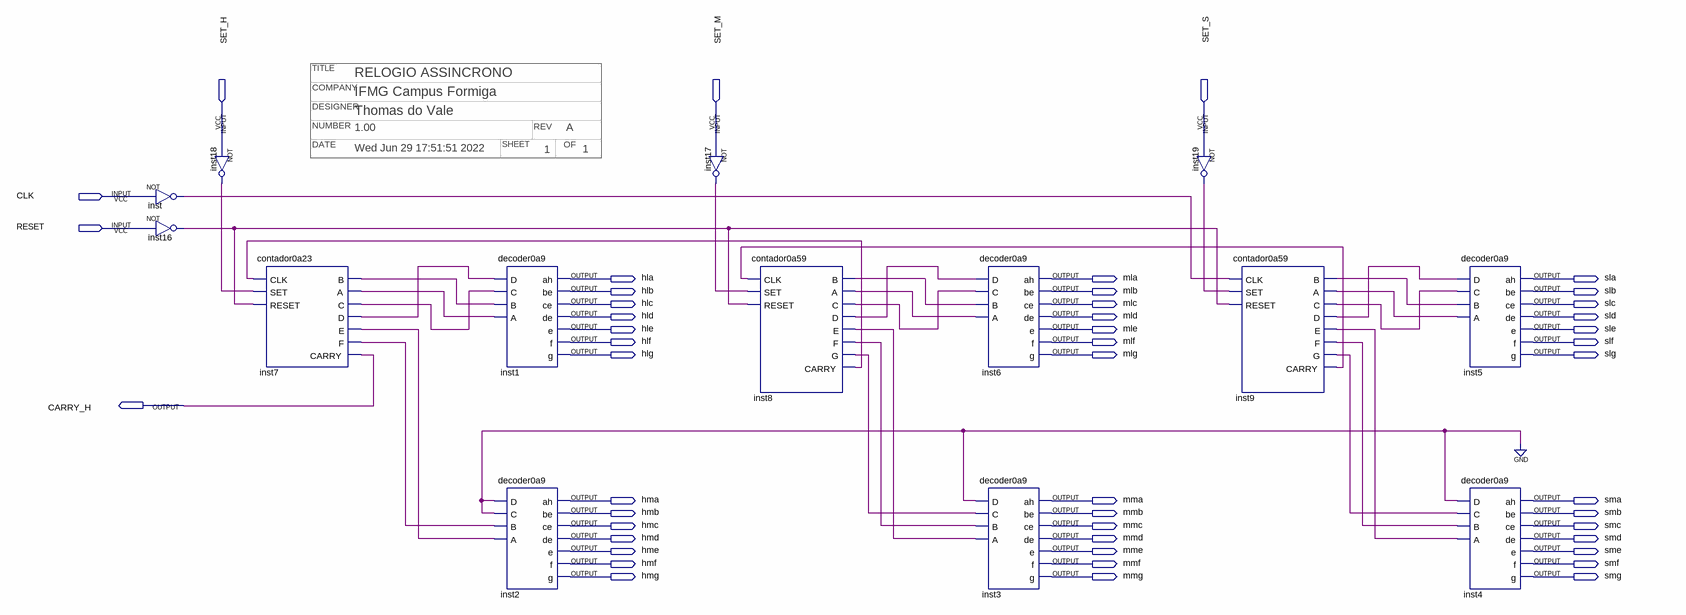
[diagram p0: schematic sheet]
// Quartus schematic principal.bdf as structural Verilog: 14 symbols, 48 pins
// Title block: COMPANY: IFMG Campus Formiga; DATE: Wed Jun 29 17:51:51 2022; DESIGNER: Thomas do Vale; NUMBER: 1.00; OF: 1; REV: A; SHEET: 1; TITLE: RELOGIO ASSINCRONO
module principal (
  input  SET_H,
  input  SET_M,
  input  SET_S,
  input  CLK,
  input  RESET,
  output hla,
  output mla,
  output sla,
  output hlb,
  output mlb,
  output slb,
  output hlc,
  output mlc,
  output slc,
  output hld,
  output mld,
  output sld,
  output hle,
  output mle,
  output sle,
  output hlf,
  output mlf,
  output slf,
  output hlg,
  output mlg,
  output slg,
  output CARRY_H,
  output hma,
  output mma,
  output sma,
  output hmb,
  output mmb,
  output smb,
  output hmc,
  output mmc,
  output smc,
  output hmd,
  output mmd,
  output smd,
  output hme,
  output mme,
  output sme,
  output hmf,
  output mmf,
  output smf,
  output hmg,
  output mmg,
  output smg
);

  wire inst7_a, inst7_b, inst7_c, inst7_d, inst7_e, inst7_f, inst8_a, inst8_b, inst8_c, inst8_carry, inst8_d,
       inst8_e, inst8_f, inst8_g, inst9_a, inst9_b, inst9_c, inst9_carry, inst9_d, inst9_e, inst9_f, inst9_g,
       inst16_out, inst17_out, inst18_out, inst19_out, inst_out;

  not inst (inst_out, CLK);
  not inst16 (inst16_out, RESET);
  not inst18 (inst18_out, SET_H);
  contador0a23 inst7 (
    .CLK(inst8_carry), .SET(inst18_out), .RESET(inst16_out), .B(inst7_b), .A(inst7_a), .C(inst7_c),
    .D(inst7_d), .E(inst7_e), .F(inst7_f), .CARRY(CARRY_H));
  decoder0a9 inst1 (
    .D(inst7_d), .C(inst7_c), .B(inst7_b), .A(inst7_a), .ah(hla), .be(hlb), .ce(hlc), .de(hld), .e(hle),
    .f(hlf), .g(hlg));
  decoder0a9 inst2 (
    .D(1'b0), .C(1'b0), .B(inst7_f), .A(inst7_e), .ah(hma), .be(hmb), .ce(hmc), .de(hmd), .e(hme), .f(hmf),
    .g(hmg));
  not inst17 (inst17_out, SET_M);
  contador0a59 inst8 (
    .CLK(inst9_carry), .SET(inst17_out), .RESET(inst16_out), .B(inst8_b), .A(inst8_a), .C(inst8_c),
    .D(inst8_d), .E(inst8_e), .F(inst8_f), .G(inst8_g), .CARRY(inst8_carry));
  decoder0a9 inst6 (
    .D(inst8_d), .C(inst8_c), .B(inst8_b), .A(inst8_a), .ah(mla), .be(mlb), .ce(mlc), .de(mld), .e(mle),
    .f(mlf), .g(mlg));
  decoder0a9 inst3 (
    .D(1'b0), .C(inst8_g), .B(inst8_f), .A(inst8_e), .ah(mma), .be(mmb), .ce(mmc), .de(mmd), .e(mme),
    .f(mmf), .g(mmg));
  not inst19 (inst19_out, SET_S);
  contador0a59 inst9 (
    .CLK(inst_out), .SET(inst19_out), .RESET(inst16_out), .B(inst9_b), .A(inst9_a), .C(inst9_c), .D(inst9_d),
    .E(inst9_e), .F(inst9_f), .G(inst9_g), .CARRY(inst9_carry));
  decoder0a9 inst5 (
    .D(inst9_d), .C(inst9_c), .B(inst9_b), .A(inst9_a), .ah(sla), .be(slb), .ce(slc), .de(sld), .e(sle),
    .f(slf), .g(slg));
  decoder0a9 inst4 (
    .D(1'b0), .C(inst9_g), .B(inst9_f), .A(inst9_e), .ah(sma), .be(smb), .ce(smc), .de(smd), .e(sme),
    .f(smf), .g(smg));
endmodule
